# Altium schematic sheet Main.SchDoc
size A3
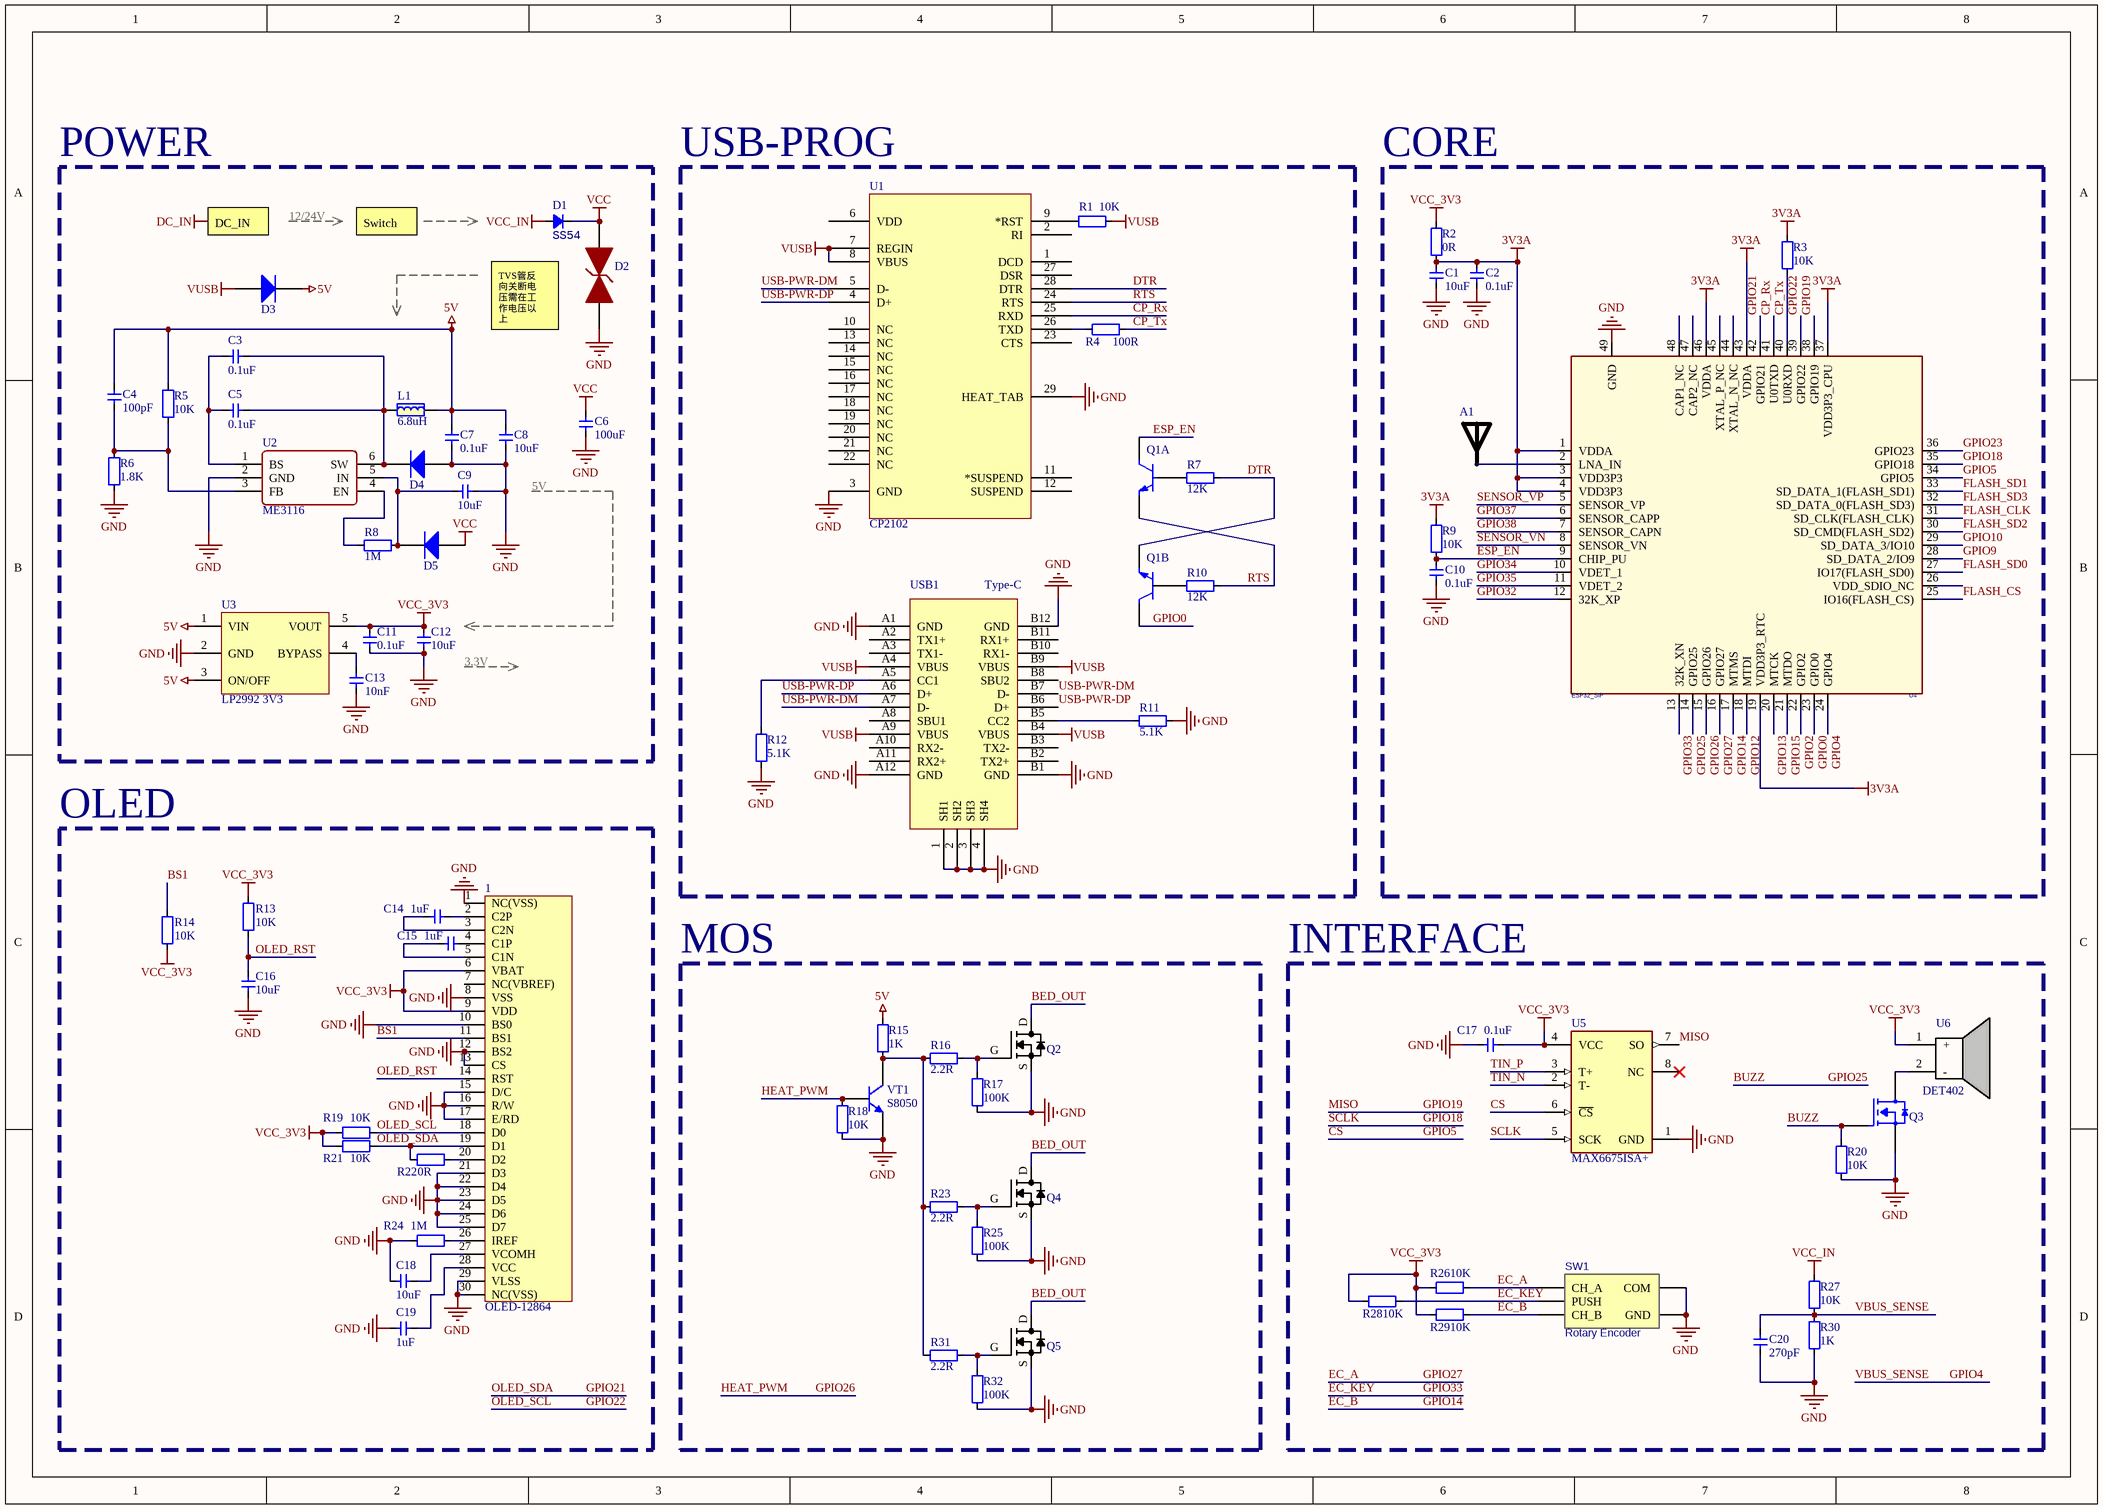
[diagram p0: Main.SchDoc]

## Parts
1  OLED-12864  [OLED-12864-1.3-TOP]
A1  RAINSUN  [ANT-Rainsun-AN5120]  (value not drawn)
C1  10uF  [CAP_0402]
C2  0.1uF  [CAP_0402]
C3  0.1uF  [CAP_0402]
C4  100pF  [CAP_0402]
C5  0.1uF  [CAP_0402]
C6  100uF  [1206-CAP]
C7  0.1uF  [CAP_0402]
C8  10uF  [CAP_0402]
C9  10uF  [CAP_0402]
C10  0.1uF  [CAP_0402]
C11  0.1uF  [CAP_0402]
C12  10uF  [CAP_0402]
C13  10nF  [CAP_0402]
C14  1uF  [CAP_0402]
C15  1uF  [CAP_0402]
C16  10uF  [CAP_0402]
C17  0.1uF  [CAP_0402]
C18  10uF  [CAP_0402]
C19  1uF  [CAP_0402]
C20  270pF  [CAP_0402]
D1  SS54  [DO-214AC]
D2  SMBJ28CA  [SMBJ-CA_MFG]  (value not drawn)
D3  二极管-5819W  [SOD-323]  (value not drawn)
D4  二极管-5819W  [SOD-323]  (value not drawn)
D5  二极管-5819W  [SOD-323]  (value not drawn)
L1  6.8uH  [IND-201612]
Q1  BC847BVC-7  [SOT563-6]  (value not drawn)  (parts A,B of 2)
Q2  NTMFS5C628NLT  [SO8FL]  (value not drawn)
Q3  AO3400A  [SOT23-3]  (value not drawn)
Q4  NTMFS5C628NLT  [SO8FL]  (value not drawn)
Q5  NTMFS5C628NLT  [SO8FL]  (value not drawn)
R1  10K  [RES_0402]
R2  0R  [RES_0402]
R3  10K  [RES_0402]
R4  100R  [RES_0402]
R5  10K  [RES_0402]
R6  1.8K  [RES_0402]
R7  12K  [RES_0402]
R8  1M  [RES_0402]
R9  10K  [RES_0402]
R10  12K  [RES_0402]
R11  5.1K  [RES_0402]
R12  5.1K  [RES_0402]
R13  10K  [RES_0402]
R14  10K  [RES_0402]
R15  1K  [RES_0402]
R16  2.2R  [RES_0402]
R17  100K  [RES_0402]
R18  10K  [RES_0402]
R19  10K  [RES_0402]
R20  10K  [RES_0402]
R21  10K  [RES_0402]
R22  0R  [RES_0402]
R23  2.2R  [RES_0402]
R24  1M  [RES_0402]
R25  100K  [RES_0402]
R26  10K  [RES_0402]
R27  10K  [RES_0402]
R28  10K  [RES_0402]
R29  10K  [RES_0402]
R30  1K  [RES_0402]
R31  2.2R  [RES_0402]
R32  100K  [RES_0402]
SW1  Rotary Encoder  [SIQ-02FVS3]
U1  CP2102  [QFN-28]
U2  ME3116  [SOT23-6]
U3  LP2992 3V3  [SOT23-5]
U4  ESP32_SIP  [QFN-48_7X7]
U5  Part Number: MAX6675ISA+  [SO-8]  (hidden comment: MAX6675ISA)
U6  DET402  [DET402]
USB1  Type-C  [Type-C-TOP]
VT1  S8050  [SMT_TRIODE_NPN]

## Blocks framed on the sheet
POWER: C3-C9 C11-C13 D1-D5 L1 R5 R6 R8 U2 U3
USB-PROG: Q1 R1 R4 R7 R10-R12 U1 USB1
CORE: A1 C1 C2 C10 R2 R3 R9 U4
OLED: 1 C14-C16 C18 C19 R13 R14 R19 R21 R22 R24
MOS: Q2 Q4 Q5 R15-R18 R23 R25 R31 R32 VT1
INTERFACE: C17 C20 Q3 R20 R26-R30 SW1 U5 U6

## Nets
3V3A: C1.2 C2.2 R2.2 R3.2 R9.1 U4.1(VDDA) U4.3(VDD3P3) U4.4(VDD3P3) U4.19(VDD3P3_RTC) U4.37(VDD3P3_CPU) U4.43(VDDA) U4.46(VDDA)
5V: C4.1 C7.2 C8.2 D3.2(K) L1.2 R5.2 R15.2 U3.1(VIN) U3.3(ON/OFF)
GND: 1.1(NC(VSS)) 1.8(VSS) 1.10(BS0) 1.12(BS2) 1.13(CS) 1.15(D/C) 1.16(R/W) 1.17(E/RD) 1.21(D3) 1.22(D4) 1.23(D5) 1.24(D6) 1.25(D7) 1.29(VLSS) 1.30(NC(VSS)) C1.1 C2.1 C6.1 C7.1 C8.1 C9.1 C10.2 C11.1 C12.1 C13.1 C16.1 C17.2 C18.2 C19.2 C20.1 D2.1 D4.1(A) Q2.S Q3.2(S) Q4.S Q5.S R6.1 R11.1 R12.2 R17.2 R18.2 R20.1 R24.1 R25.2 R30.2 R32.2 SW1.3(COM) SW1.5(GND) U1.3(GND) U1.29(HEAT_TAB) U2.2(GND) U3.2(GND) U4.49(GND) U5.1(GND) USB1.1(SH1) USB1.2(SH2) USB1.3(SH3) USB1.4(SH4) USB1.A1(GND) USB1.A12(GND) USB1.B1(GND) USB1.B12(GND) VT1.2(E)
VCC: C6.2 D1.2(K) D2.2 D5.1(A)
VCC_3V3: 1.6(VBAT) 1.9(VDD) C11.2 C12.2 C17.1 R2.1 R13.2 R14.1 R19.1 R21.1 R26.2 R28.2 R29.2 U3.5(VOUT) U5.4(VCC) U6.1(+)
VCC_IN: D1.1(A) R27.1
VUSB: D3.1(A) R1.1 U1.7(REGIN) U1.8(VBUS) USB1.A4(VBUS) USB1.A9(VBUS) USB1.B4(VBUS) USB1.B9(VBUS)
BED_OUT: Q2.D Q4.D Q5.D
BS1: 1.11(BS1) R14.2
BUZZ: Q3.1(G) R20.2 U4.14(GPIO25)  [also labelled GPIO25]
CP_Rx: U1.25(RXD) U4.41(U0TXD)
CP_Tx: R3.1 R4.1 U4.40(U0RXD)
CS: U4.34(GPIO5) U5.6(~{CS})  [also labelled GPIO5]
DTR: Q1.4(E2) R7.1 U1.28(DTR)
EC_A: R26.1 SW1.1(CH_A) U4.16(GPIO27)  [also labelled GPIO27]
EC_B: R29.1 SW1.4(CH_B) U4.17(MTMS)  [also labelled GPIO14]
EC_KEY: R28.1 SW1.2(PUSH) U4.13(32K_XN)  [also labelled GPIO33]
ESP_EN: C10.1 Q1.6(C1) R9.2 U4.9(CHIP_PU)
FLASH_CLK: U4.31(SD_CLK(FLASH_CLK))
FLASH_CS: U4.25(IO16(FLASH_CS))
FLASH_SD0: U4.27(IO17(FLASH_SD0))
FLASH_SD1: U4.33(SD_DATA_1(FLASH_SD1))
FLASH_SD2: U4.30(SD_CMD(FLASH_SD2))
FLASH_SD3: U4.32(SD_DATA_0(FLASH_SD3))
GPIO0: Q1.3(C2) U4.23(GPIO0)
GPIO2: U4.22(GPIO2)
GPIO4: C20.2 R27.2 R30.1 U4.24(GPIO4)  [also labelled VBUS_SENSE]
GPIO9: U4.28(SD_DATA_2/IO9)
GPIO10: U4.29(SD_DATA_3/IO10)
GPIO12: U4.18(MTDI)
GPIO13: U4.20(MTCK)
GPIO15: U4.21(MTDO)
GPIO18: U4.35(GPIO18) U5.5(SCK)  [also labelled SCLK]
GPIO19: U4.38(GPIO19) U5.7(SO)  [also labelled MISO]
GPIO21: 1.19(D1) R21.2 R22.2 U4.42(GPIO21)  [also labelled OLED_SDA]
GPIO22: 1.18(D0) R19.2 U4.39(GPIO22)  [also labelled OLED_SCL]
GPIO23: U4.36(GPIO23)
GPIO26: R18.1 U4.15(GPIO26) VT1.1(B)  [also labelled HEAT_PWM]
GPIO32: U4.12(32K_XP)
GPIO34: U4.10(VDET_1)
GPIO35: U4.11(VDET_2)
GPIO37: U4.6(SENSOR_CAPP)
GPIO38: U4.7(SENSOR_CAPN)
OLED_RST: 1.14(RST) C16.2 R13.1
RTS: Q1.1(E1) R10.1 U1.24(RTS)
SENSOR_VN: U4.8(SENSOR_VN)
SENSOR_VP: U4.5(SENSOR_VP)
TIN_N: U5.2(T-)
TIN_P: U5.3(T+)
USB-PWR-DM: U1.5(D-) USB1.A7(D-) USB1.B7(D-)
USB-PWR-DP: U1.4(D+) USB1.A6(D+) USB1.B6(D+)
Net1_2: 1.2(C2P) C14.1
Net1_3: 1.3(C2N) C14.2
Net1_4: 1.4(C1P) C15.1
Net1_5: 1.5(C1N) C15.2
Net1_20: 1.20(D2) R22.1
Net1_26: 1.26(IREF) R24.2
Net1_27: 1.27(VCOMH) C18.1
Net1_28: 1.28(VCC) C19.1
NetA1_1: A1.1 U4.2(LNA_IN)
NetC3_1: C3.1 C5.1 D4.2(K) L1.1 U2.6(SW)
NetC3_2: C3.2 C5.2 U2.1(BS)
NetC4_2: C4.2 R5.1 R6.2 U2.3(FB)
NetC9_2: C9.2 D5.2(K) R8.1 U2.5(IN)
NetC13_2: C13.2 U3.4(BYPASS)
NetQ1_2: Q1.2(B1) R7.2
NetQ1_5: Q1.5(B2) R10.2
NetQ2_G: Q2.G R16.1 R17.1
NetQ3_3: Q3.3(D) U6.2(-)
NetQ4_G: Q4.G R23.1 R25.1
NetQ5_G: Q5.G R31.1 R32.1
NetR1_2: R1.2 U1.9(*RST)
NetR4_2: R4.2 U1.26(TXD)
NetR8_2: R8.2 U2.4(EN)
NetR11_2: R11.2 USB1.B5(CC2)
NetR12_1: R12.1 USB1.A5(CC1)
NetR15_1: R15.1 R16.2 R23.2 R31.2 VT1.3(C)

Not connected (* = marked no-connect by the designer): 1 7(NC(VBREF)); U1 1(DCD) 2(RI) 6(VDD) 10(NC) 11(*SUSPEND) 12(SUSPEND) 13(NC) 14(NC) 15(NC) 16(NC) 17(NC) 18(NC) 19(NC) 20(NC) 21(NC) 22(NC) 23(CTS) 27(DSR); U4 26(VDD_SDIO_NC) 44(XTAL_N_NC) 45(XTAL_P_NC) 47(CAP2_NC) 48(CAP1_NC); U5 8(NC)*; USB1 A2(TX1+) A3(TX1-) A8(SBU1) A10(RX2-) A11(RX2+) B2(TX2+) B3(TX2-) B8(SBU2) B10(RX1-) B11(RX1+)

## Notes on the sheet
- DC_IN
- 12/24V
- Switch
- TVS管反
  向关断电
  压需在工
  作电压以
  上
- 5V
- (near C12) 3.3V
- Labels drawn without touching a wire or pin: DC_IN

## Library data of the parts
1 = OLED-12864: 显示屏
A1 = ANT-Rainsun-AP5120
C1-C5 C7-C20 = 电容-0402: Capacitor; Value: 0.1u
C6 = 电容-1206: Capacitor; Value: 0.1u
D1 = Diode_SMA: Diode; Type: SMA; Value: SS54
D3-D5 = 二极管-5819W: 40V
L1 = 电感-201612
Q2 Q4 Q5 = NTMFS5C628NLT: MOSFET N-CH 60V SO8FL; Manufacturer: ON Semiconductor; Manufacturer Part Number: NTMFS5C628NLT1G; FET Type: N-Channel; Drive Voltage (Max Rds On,  Min Rds On): 4.5V, 10V; Vgs(th) (Max) @ Id: 2V @ 135µA; Gate Charge (Qg) (Max) @ Vgs: 52nC @ 10V; Input Capacitance (Ciss) (Max) @ Vds: 3600pF @ 25V; Vgs (Max): ±20V; Power Dissipation (Max): 3.7W (Ta), 110W (Tc); Rds On (Max) @ Id, Vgs: 2.4 mOhm @ 50A, 10V; Supplier 1: Digi-Key; Supplier Part Number 1: NTMFS5C628NLT1GOSCT-ND; RoHS: RoHS Compliant; Category: Discrete Semiconductor Products; Stock: 1490; Pricing 1: 1=1.8, 10=1.627, 100=1.3078, 500=1.01716 (USD); Packaging: Cut Tape (CT); Part Status: Active; Technology: MOSFET (Metal Oxide); Current - Continuous Drain (Id) @ 25°C: -; FET Feature: -; Operating Temperature: -55°C ~ 175°C (TJ); Mounting Type: Surface Mount; Supplier Device Package: 5-DFN (5x6) (8-SOFL); Package / Case: 8-PowerTDFN; ComponentLink1URL: http://www.onsemi.com/pub/Collateral/NTMFS5C628NL-D.PDF; ComponentLink1Description: http://www.onsemi.com/pub/Collateral/NTMFS5C628NL-D.PDF; Supplier 2: Digi-Key; Supplier Part Number 2: NTMFS5C628NLT1GOSTR-ND; Pricing 2: 1500=0.81823 (USD)
Q3 = AO3400A: N-MOS
R1-R32 = 电阻-0402: Resistor; Value: 22R
SW1 = Rotary Encoder: BOM_Manufacturer: ALPSALPINE; BOM_Manufacturer Part: EC11E1534443; Contributor: LCSC; BOM_Supplier: LCSC; BOM_Supplier Part: C1322543; BOM_JLCPCB Part Class: Extended Part; spicePre: S; spiceSymbolName: EC11E1534443
U1 = CP2102: USB转TTL; PART DESC: SINGLE-CHIP USB TO UART BRIDGE, QFN28, RoHS.; MFG #1: SILICON LABS; PART NUMBER: CP2102; Value: Value; RefDes: RefDes; Type: DEV
U2 = ME3116: DC-DC
U3 = LP2992: LDO
U4 = ESP32-PICO
U5 = MAX6675ISA: IC THERMOCOUP TO DGTL 8-SOIC; Manufacturer: Maxim Electronics; Category 9E07530Daf1645C0: Semiconductors and Actives; Category 3Cb8F1B20D37E77F: Sensors (Acceleration, Pressure, ...); Category 8A76477Cb9Bd51B1: Temperature Control and Regulation; Category 84F649Fcb0Ed5F31: Uncategorized; max_supply_voltage_dc: 5.50V; Category D46C1966E09E0Fab: Temperature; Category Db391633E8F300Fe: Industrial Control; Category C33B0E31F09B18Fc: Temperature Sensor ICs; Mfg Package Ident: 21-0041; Category E95E2454Daf93299: Temperature Sensing/Measurement; Category 2Fc5E2Cf1B85F402: Interface ICs; Category 6B95A69F5F75B052: Sensors and Accessories; Symbol 0 0: Standard; Num Pins: 8; supply_current: 0.70 mA; helpURL: https://upverter.com/upn/revision/df8f98e99e77f28c/; ComponentLink2Description: Datasheet; Temperature: -20°C to +85°C; Package: 21-0041; Supplier 2: Mouser; Supplier 1: Digi-Key; ComponentLink1URL: https://upverter.com/upn/revision/df8f98e99e77f28c/; Supplier Part Number 2: 700-MAX6675ISA; Supplier Part Number 1: MAX6675ISA+-ND; ComponentLink1Description: Upverter; ComponentLink2URL: https://upverter.com/datasheet/328f41e80cd5fba93d602566d8324382201f26da.pdf; RoHS: TRUE; Temperature Range High: +85°C; Octopart Part Number: 33bcfab92ad8ec7b; Digikey Description: IC THERMOCOUP TO DGTL 8-SOIC; Digikey Part Number: MAX6675ISA+-ND; Lead Free: yes; Type: integrated circuit; Category 20B3Edb914A9Fb74: Uncategorized; Mouser Part Number: 700-MAX6675ISA; Temperature Range Low: -20°C; Category 3B3Df6370Ab4E0Fa: Temperature Sensor ICs; Mounting Type: surface mount; Ipc Land Pattern Name: SOIC127P600X155-8
USB1 = USB-Type-C-TOP
VT1 = SMT_TRIODE_NPN: Surface mount NPN transistor, package SOT-23